# Altium schematic sheet sematik_mos.SchDoc
size A4
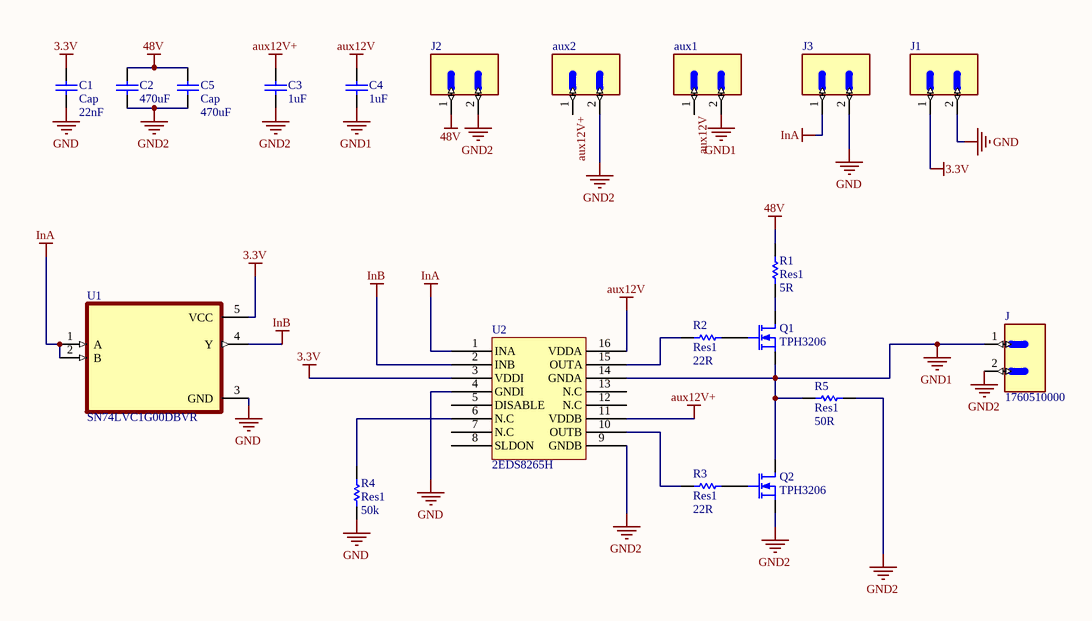
[diagram p0: sematik_mos.SchDoc]

## Parts
aux1  1760510000  [1760490000]  (value not drawn)
aux2  1760510000  [1760490000]  (value not drawn)
C1  Cap  value 22nF  [RAD-0.3]
C2  470uF  [RAD-0.3]
C3  1uF  [RAD-0.3]
C4  1uF  [RAD-0.3]
C5  Cap  value 470uF  [RAD-0.3]
J  1760510000  [1760490000]
J1  1760510000  [1760490000]  (value not drawn)
J2  1760510000  [1760490000]  (value not drawn)
J3  1760510000  [1760490000]  (value not drawn)
Q1  TPH3206  [tph3206_powmos]
Q2  TPH3206  [tph3206_powmos]
R1  Res1  value 5R  [AXIAL-0.3]
R2  Res1  value 22R  [AXIAL-0.3]
R3  Res1  value 22R  [AXIAL-0.3]
R4  Res1  value 50k  [AXIAL-0.3]
R5  Res1  value 50R  [AXIAL-0.3]
U1  SN74LVC1G00DBVR  [SOT95P280X145-5N]
U2  2EDS8265H  [2eds8265h_pcb]

## Nets
3.3V: C1.2 J1.1 U1.5(VCC) U2.3(VDDI)
48V: C2.2 C5.2 J2.1 R1.2
aux12V: aux1.1 C4.2 U2.16(VDDA)
aux12V+: aux2.1 C3.2 U2.11(VDDB)
GND: C1.1 J1.2 J3.2 R4.1 U1.3(GND) U2.4(GNDI)
GND1: aux1.2 C4.1 J.1 Q1.2(S) Q2.3(D) R5.2 U2.14(GNDA)
GND2: aux2.2 C2.1 C3.1 C5.1 J.2 J2.2 Q2.2(S) R5.1 U2.9(GNDB)
InA: J3.1 U1.1(A) U1.2(B) U2.1(INA)
InB: U1.4(Y) U2.2(INB)
NetQ1_1: Q1.1(G) R2.1
NetQ1_3: Q1.3(D) R1.1
NetQ2_1: Q2.1(G) R3.1
NetR2_2: R2.2 U2.15(OUTA)
NetR3_2: R3.2 U2.10(OUTB)
NetR4_2: R4.2 U2.6(N.C)

Not connected (* = marked no-connect by the designer): U2 5(DISABLE) 7(N.C) 8(SLDON) 12(N.C) 13(N.C)

## Library data of the parts
aux1 aux2 J J1-J3 = 1760510000: 2 Position Wire to Board Terminal Block Horizontal with Board 0.200 _5.08mm_ Through Hole; MF: Weidmuller; Package: None; Price: None; SnapEDA_Link: https://www.snapeda.com/parts/1760510000/Weidmuller/view-part/286722/?ref=snap; Availability: Unavailable; Value: *; MP: 1760510000
C1-C5 = Cap: Capacitor; Published: 8-Jun-2000; LatestRevisionDate: 17-Jul-2002; LatestRevisionNote: Re-released for DXP Platform.; PackageReference: RAD-0.3; Publisher: Altium Limited; PackageDescription: Radial Cap, Thru-Hole; 2 Leads; 0.3 in Pin Spacing
Q1 Q2 = mosfetss
R1-R5 = Res1: Resistor; Published: 8-Jun-2000; LatestRevisionDate: 17-Jul-2002; LatestRevisionNote: Re-released for DXP Platform.; PackageReference: AXIAL-0.3; Publisher: Altium Limited; PackageDescription: Axial Device, Thru-Hole; 2 Leads; 0.3 in Pin Spacing
U1 = SN74LVC1G00DBVR: Single 2 Input Positive NAND Gate 5-SOT-23 -40 to 125; MF: Texas Instruments; Package: SOT-23-5 Texas Instruments; MP: SN74LVC1G00DBVR; Price: None; Value: *; Texas_Instruments-Purchase-URL: https://snapeda.com/shop?store=Texas+Instruments&id=410267; Availability: Unavailable; SnapEDA_Link: https://www.snapeda.com/parts/SN74LVC1G00DBVR/Texas%20Instruments/view-part/410267/?ref=snap; BuyPart: https://www.snapeda.com/parts/SN74LVC1G00DBVR/Texas%20Instruments/view-part/410267/?ref=eda
U2 = Component_1: DSO-16 socket surface mount